# Altium schematic sheet ESP32.SchDoc: Motherboard-ESP32
size A3; DrawnBy: Patryk Bujak; DocumentNumber: 12; Revision: 1.0; SheetNumber: 9; SheetTotal: 10; Author: Patryk Bujak
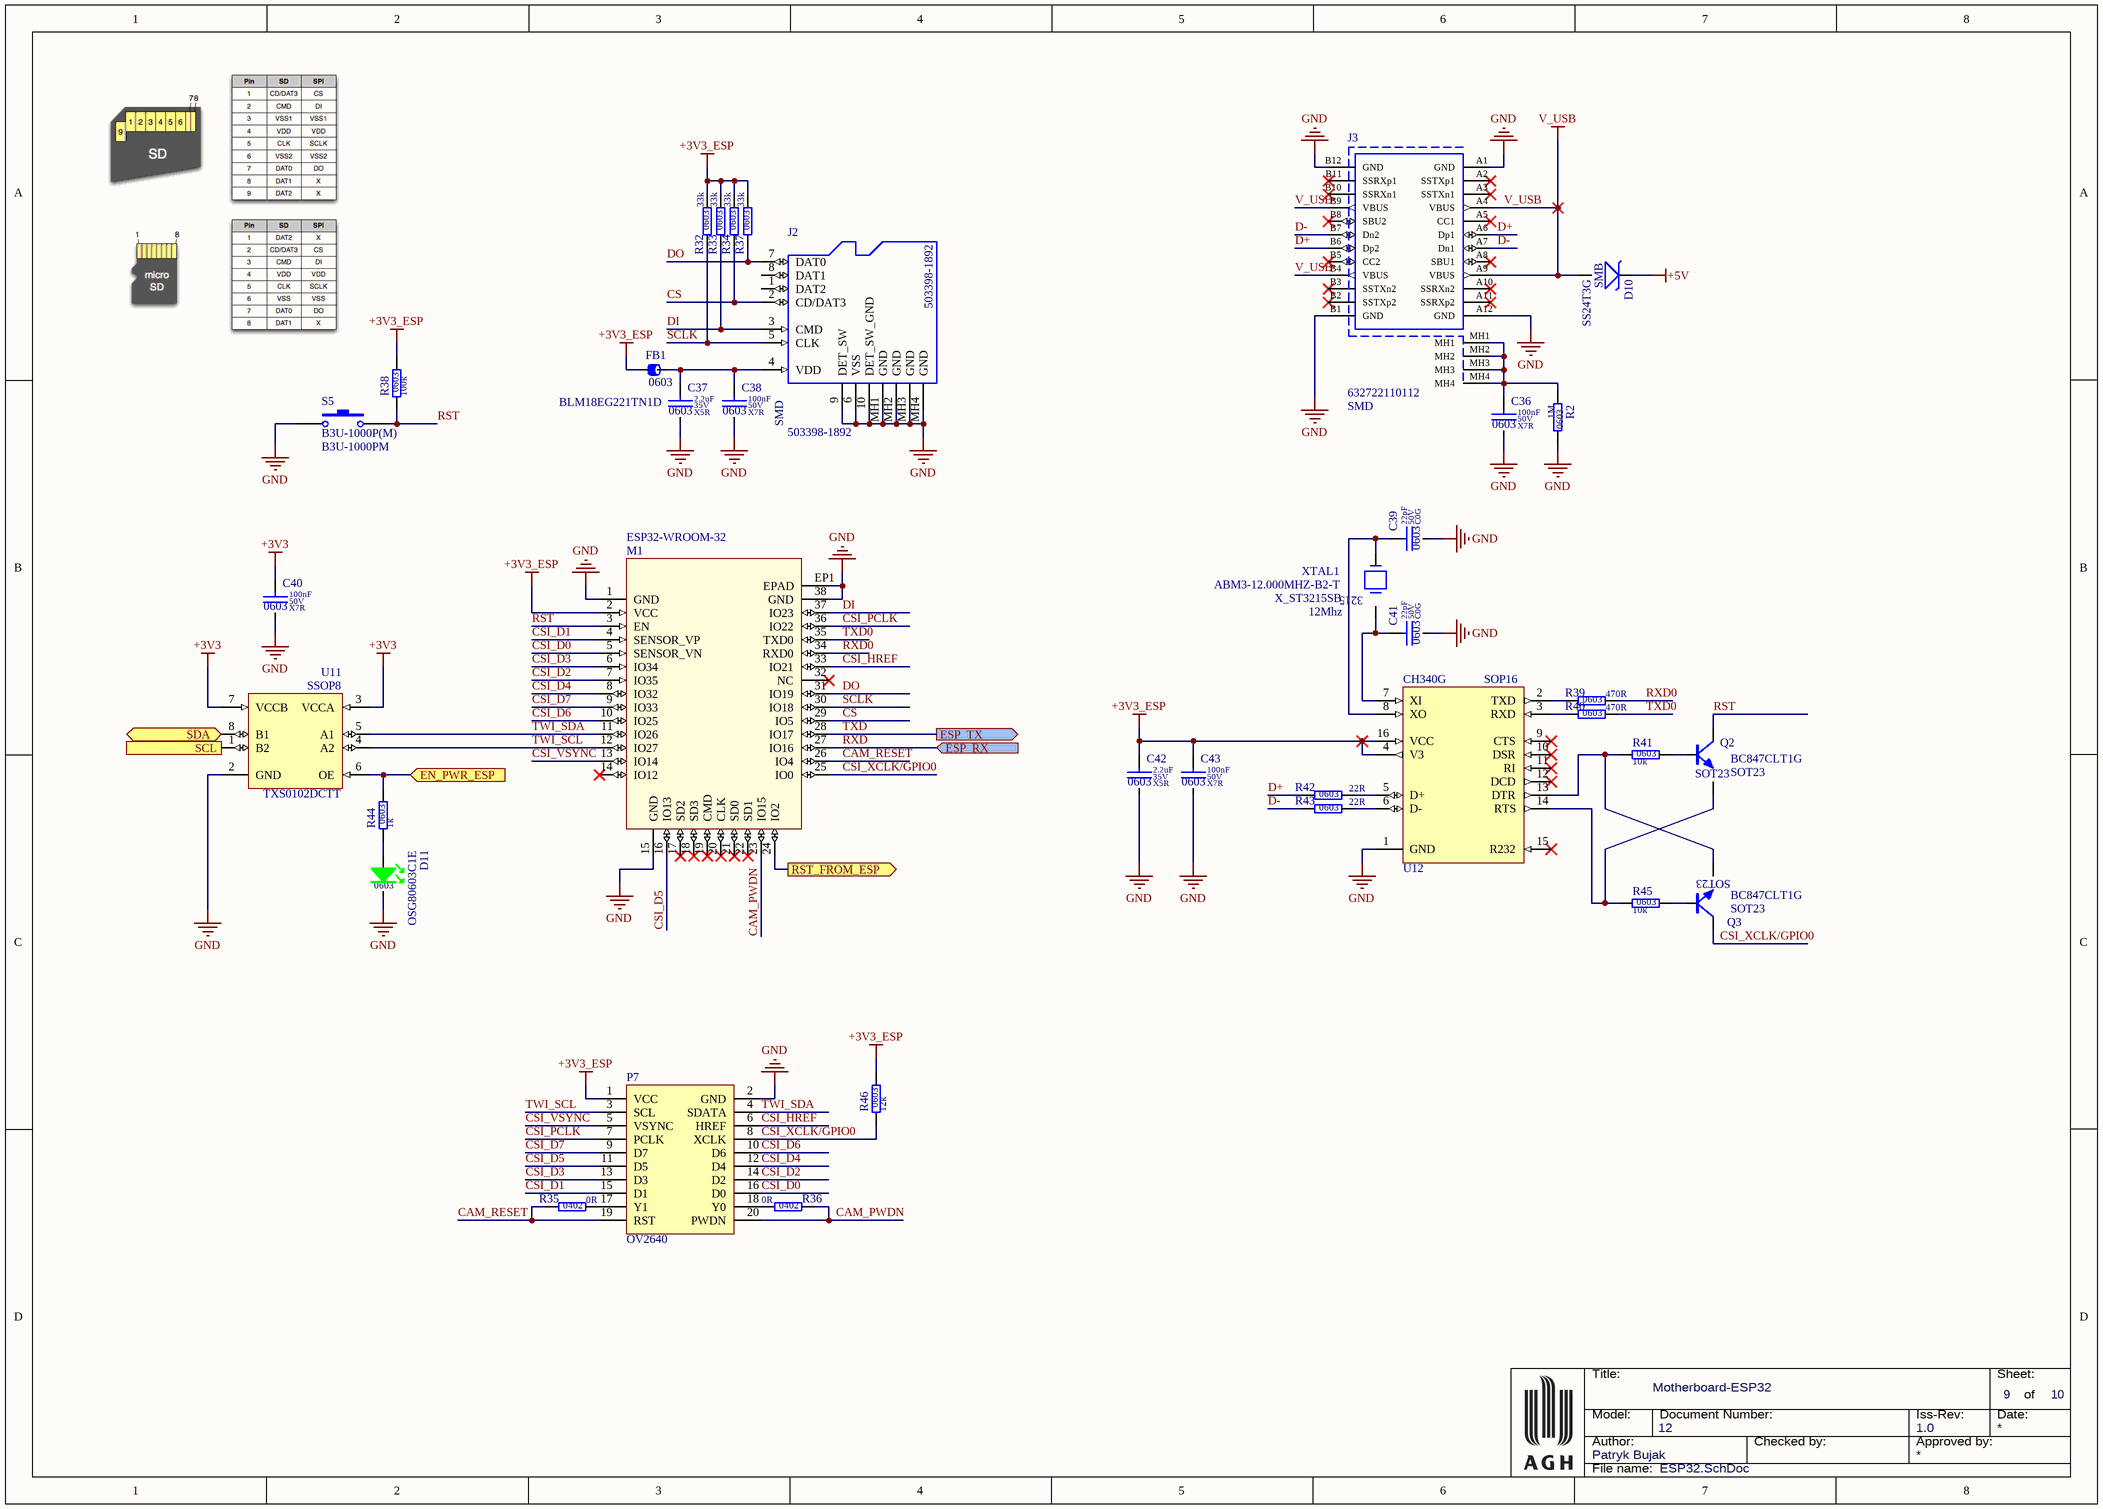
[diagram p0: ESP32.SchDoc]

## Parts
C36  value 100nF  Dielectric: X7R  Voltage: 50V  SCH_Footprint: 0603  [C_0603_1608]  (hidden comment: Ceramic X7R)
C37  value 2.2uF  Dielectric: X5R  Voltage: 35V  SCH_Footprint: 0603  [C_0603_1608]  (hidden comment: Ceramic X5R)
C38  value 100nF  Dielectric: X7R  Voltage: 50V  SCH_Footprint: 0603  [C_0603_1608]  (hidden comment: Ceramic X7R)
C39  value 22pF  Dielectric: C0G  Voltage: 50V  SCH_Footprint: 0603  [C_0603_1608]  (hidden comment: Ceramic C0G)
C40  value 100nF  Dielectric: X7R  Voltage: 50V  SCH_Footprint: 0603  [C_0603_1608]  (hidden comment: Ceramic X7R)
C41  value 22pF  Dielectric: C0G  Voltage: 50V  SCH_Footprint: 0603  [C_0603_1608]  (hidden comment: Ceramic C0G)
C42  value 2.2uF  Dielectric: X5R  Voltage: 35V  SCH_Footprint: 0603  [C_0603_1608]  (hidden comment: Ceramic X5R)
C43  value 100nF  Dielectric: X7R  Voltage: 50V  SCH_Footprint: 0603  [C_0603_1608]  (hidden comment: Ceramic X7R)
D10  value SS24T3G  SCH_Footprint: SMB  [SMB_DO-214AA]  (hidden comment: SS24)
D11  value OSG80603C1E  SCH_Footprint: 0603  [OL_0603_1608]  (hidden comment: Green led)
FB1  value BLM18EG221TN1D  SCH_Footprint: 0603  [FB_0603_1608]  (hidden comment: Ferrite bead)
J2  value 503398-1892  SCH_Footprint: SMD  [503398-1892]  (hidden comment: SD Card Connector)
J3  value 632722110112  SCH_Footprint: SMD  [J_USB_C_3.1_Vertical]  (hidden comment: USB C Connector)
M1  value ESP32-WROOM-32  [MOD_ESP_WROOM_32]  (hidden comment: 2.4 GHz Wi-Fi-and-Bluetooth combo chip)
P7  OV2640  [H2X10_OV2640]
Q2  value BC847CLT1G  SCH_Footprint: SOT23  [SOT23_TO236_SC59]  (hidden comment: BC847C)
Q3  value BC847CLT1G  SCH_Footprint: SOT23  [SOT23_TO236_SC59]  (hidden comment: BC847C)
R2  value 1M  SCH_Footprint: 0603  [R_0603_1608]  (hidden comment: Resistor)
R32  value 33k  SCH_Footprint: 0603  [R_0603_1608]  (hidden comment: Resistor)
R33  value 33k  SCH_Footprint: 0603  [R_0603_1608]  (hidden comment: Resistor)
R34  value 33k  SCH_Footprint: 0603  [R_0603_1608]  (hidden comment: Resistor)
R35  value 0R  SCH_Footprint: 0402  [R_0402_1005]  (hidden comment: Resistor)
R36  value 0R  SCH_Footprint: 0402  [R_0402_1005]  (hidden comment: Resistor)
R37  value 33k  SCH_Footprint: 0603  [R_0603_1608]  (hidden comment: Resistor)
R38  value 100k  SCH_Footprint: 0603  [R_0603_1608]  (hidden comment: Resistor)
R39  value 470R  SCH_Footprint: 0603  [R_0603_1608]  (hidden comment: Resistor)
R40  value 470R  SCH_Footprint: 0603  [R_0603_1608]  (hidden comment: Resistor)
R41  value 10k  SCH_Footprint: 0603  [R_0603_1608]  (hidden comment: Resistor)
R42  value 22R  SCH_Footprint: 0603  [R_0603_1608]  (hidden comment: Resistor)
R43  value 22R  SCH_Footprint: 0603  [R_0603_1608]  (hidden comment: Resistor)
R44  value 1k  SCH_Footprint: 0603  [R_0603_1608]  (hidden comment: Resistor)
R45  value 10k  SCH_Footprint: 0603  [R_0603_1608]  (hidden comment: Resistor)
R46  value 12k  SCH_Footprint: 0603  [R_0603_1608]  (hidden comment: Resistor)
S5  value B3U-1000PM  SCH_Footprint: B3U-1000P(M)  [B3U-1000P]  (hidden comment: Ultra-small Tactile Switch)
U11  value TXS0102DCTT  SCH_Footprint: SSOP8  [SSOP8_3x3]  (hidden comment: 2-Bit Bidirectional Voltage-Level Shifter for Open-Drain and Push-Pull Application 8-VSSOP -40 to 85)
U12  value CH340G  SCH_Footprint: SOP16  [SOP16_SO16_SOIC16_4X10X6]  (hidden comment: USB to serial chip)
XTAL1  value 12Mhz  Manufacturer Part Number: ABM3-12.000MHZ-B2-T  [X_ABM3-12.000MHZ-B2-T]  (hidden comment: X_ST3215SB)

## Ports
EN_PWR_ESP (in), ESP_RX (in), ESP_TX (out), RST_FROM_ESP (out), SCL (in), SDA (bidir)

## Nets
+3V3: C40.1 U11.3(VCCA) U11.7(VCCB)
+3V3_ESP: C42.1 C43.1 FB1.1 M1.2(VCC) P7.1(VCC) R32.2 R33.2 R34.2 R37.2 R38.2 R46.2 U12.4(V3) U12.16(VCC)
+5V: D10.1
GND: C36.2 C37.2 C38.2 C39.2 C40.2 C41.2 C42.2 C43.2 D11.1(K) J2.6(VSS) J2.9(DET_SW) J2.10(DET_SW_GND) J2.MH1(GND) J2.MH2(GND) J2.MH3(GND) J2.MH4(GND) J3.A1(GND) J3.A12(GND) J3.B1(GND) J3.B12(GND) M1.1(GND) M1.15(GND) M1.38(GND) M1.EP1(EPAD) P7.2(GND) R2.2 S5.1 U11.2(GND) U12.1(GND)
V_USB: D10.2 J3.A4(VBUS) J3.A9(VBUS) J3.B4(VBUS) J3.B9(VBUS)
CAM_PWDN: M1.23(IO15) P7.20(PWDN) R36.2
CAM_RESET: M1.26(IO4) P7.19(RST) R35.1
CS: J2.2(CD/DAT3) M1.29(IO5) R34.1
CSI_D0: M1.5(SENSOR_VN) P7.16(D0)
CSI_D1: M1.4(SENSOR_VP) P7.15(D1)
CSI_D2: M1.7(IO35) P7.14(D2)
CSI_D3: M1.6(IO34) P7.13(D3)
CSI_D4: M1.8(IO32) P7.12(D4)
CSI_D5: M1.16(IO13) P7.11(D5)
CSI_D6: M1.10(IO25) P7.10(D6)
CSI_D7: M1.9(IO33) P7.9(D7)
CSI_HREF: M1.33(IO21) P7.6(HREF)
CSI_PCLK: M1.36(IO22) P7.7(PCLK)
CSI_VSYNC: M1.13(IO14) P7.5(VSYNC)
CSI_XCLK/GPIO0: M1.25(IO0) P7.8(XCLK) Q3.3(C) R46.1
D+: J3.A6(Dp1) J3.B6(Dp2) R42.1
D-: J3.A7(Dn1) J3.B7(Dn2) R43.1
DI: J2.3(CMD) M1.37(IO23) R33.1
DO: J2.7(DAT0) M1.31(IO19) R37.1
EN_PWR_ESP: R44.2 U11.6(OE) ; port EN_PWR_ESP
RST: M1.3(EN) Q2.3(C) R38.1 S5.2
RST_FROM_ESP: M1.24(IO2) ; port RST_FROM_ESP
RXD: M1.27(IO16) ; port ESP_RX
RXD0: M1.34(RXD0) R39.2
SCL: U11.1(B2) ; port SCL
SCLK: J2.5(CLK) M1.30(IO18) R32.1
SDA: U11.8(B1) ; port SDA
TWI_SCL: M1.12(IO27) P7.3(SCL) U11.4(A2)
TWI_SDA: M1.11(IO26) P7.4(SDATA) U11.5(A1)
TXD: M1.28(IO17) ; port ESP_TX
TXD0: M1.35(TXD0) R40.2
NetC36_1: C36.1 J3.MH1 J3.MH2 J3.MH3 J3.MH4 R2.1
NetC37_1: C37.1 C38.1 FB1.2 J2.4(VDD)
NetC39_1: C39.1 U12.8(XO) XTAL1.2
NetC41_1: C41.1 U12.7(XI) XTAL1.1
NetD11_2: D11.2(A) R44.1
NetP7_17: P7.17(Y1) R35.2
NetP7_18: P7.18(Y0) R36.1
NetQ2_1: Q2.1(B) R41.2
NetQ2_2: Q2.2(E) R45.1 U12.14(RTS)
NetQ3_1: Q3.1(B) R45.2
NetQ3_2: Q3.2(E) R41.1 U12.13(DTR)
NetR39_1: R39.1 U12.2(TXD)
NetR40_1: R40.1 U12.3(RXD)
NetR42_2: R42.2 U12.5(D+)
NetR43_2: R43.2 U12.6(D-)

Not connected (* = marked no-connect by the designer): J2 1(DAT2) 8(DAT1); J3 A2(SSTXp1)* A3(SSTXn1)* A5(CC1)* A8(SBU1)* A10(SSRXn2)* A11(SSRXp2)* B2(SSTXp2)* B3(SSTXn2)* B5(CC2)* B8(SBU2)* B10(SSRXn1)* B11(SSRXp1)*; M1 14(IO12)* 17(SD2)* 18(SD3)* 19(CMD)* 20(CLK)* 21(SD0)* 22(SD1)* 32(NC)*; U12 9(CTS)* 10(DSR)* 11(RI)* 12(DCD)* 15(R232)*

## Notes on the sheet
- Title:
- Sheet:
- of
- Author:
- Model:
- Document Number:
- Checked by:
- Iss-Rev:
- Approved by:
- Date:
- File name:
- (in symbol X_ABM3-12.000MHZ-B2-T) 3215

## Library data of the parts
C36 C38 C40 C43 = C_100nF_50V_X7R_0603_5: Capacitor; Manufacturer: Samsung; Manufacturer Part Number: CL10B104JB8NNNC; Tolerance (%): 5; Part Number: C_100nF_50V_X7R_0603_5; HelpURL: http://www.tme.eu/pl/Document/4a42202b32dab16128fe107dd69598cc/samsung-chip-cap.pdf; Supplier 1: TME; Supplier Part Number 1: CL10B104JB8NNNC; Supplier 2: RS Components; Supplier 3: Farnell; Supplier 4: Mouser; Supplier 5: Digi-Key
C37 C42 = C_2.2uF_35V_X5R_0603_10: Capacitor; Manufacturer: Murata; Manufacturer Part Number: GRM188R6YA225KA12D; Tolerance (%): 10; Part Number: C_2.2uF_35V_X5R_0603_10; HelpURL: https://datasheet.octopart.com/GRM188R6YA225KA12D-Murata-datasheet-66077095.pdf; Supplier 1: TME; Supplier 2: RS Components; Supplier Part Number 2: 8151358; Supplier 3: Farnell; Supplier Part Number 3: 2611926; Supplier 4: Mouser; Supplier Part Number 4: 81-GRM188R6YA225KA2D; Supplier 5: Digi-Key; Supplier Part Number 5: 490-7204-1-ND
C39 C41 = C_22pF_50V_C0G_0603_5: Capacitor; Manufacturer: AVX; Manufacturer Part Number: 06035A220JAT2A; Tolerance (%): 5; Part Number: C_22pF_50V_C0G_0603_5; HelpURL: https://datasheet.octopart.com/06035A220JAT2A-AVX-datasheet-9883399.pdf; Supplier 1: TME; Supplier 2: RS Components; Supplier Part Number 2: 1349628; Supplier 3: Farnell; Supplier Part Number 3: 2280861; Supplier 4: Mouser; Supplier Part Number 4: 581-06035A220J; Supplier 5: Digi-Key; Supplier Part Number 5: 478-1167-1-ND
D10 = DS_SS24_2A_40V_SMB: Manufacturer: ON Semiconductor; Voltage: 40V; Current: 2A; Part Number: DS_SS24_2A_40V_SMB; Manufacturer Part Number: SS24T3G; Supplier 1: TME; Supplier 2: RS Components; Supplier 3: Farnell; Supplier 4: Mouser; Supplier 5: Digi-Key; Supplier Part Number 5: SS24T3GOSCT-ND
D11 = OL_G_0603_OSG80603C1E: LED GREEN; Manufacturer: Optosupply; Part Number: OL_G_0603_OSG80603C1E; Manufacturer Part Number: OSG80603C1E; Supplier 1: TME; Supplier Part Number 1: OSG80603C1E; Supplier 2: RS Components; Supplier 3: Farnell; Supplier 4: Mouser; Supplier 5: Digi-Key
FB1 = FB_BLM18EG221TN1D: Manufacturer: Murata; Current: 1A; Resistance: 150mR; Part Number: FB_BLM18EG221TN1D; HelpURL: http://datasheet.octopart.com/BLM18EG221TN1D-Murata-datasheet-66919.pdf; Manufacturer Part Number: BLM18EG221TN1D; Supplier 1: TME; Supplier 2: RS Components; Supplier Part Number 2: 7926243P; Supplier 3: Farnell; Supplier Part Number 3: 1515717; Supplier 4: Mouser; Supplier Part Number 4: 81-BLM18EG221TN1D; Supplier 5: Digi-Key; Supplier Part Number 5: 490-5979-1-ND
J2 = J_MICRO_SD_503398-1892: J_MICRO_SD; Manufacturer: Molex; Manufacturer Part Number: 503398-1892; Part Number: J_MICRO_SD_503398-1892; Component Type: Standard; HelpURL: https://www.molex.com/pdm_docs/sd/5033981892_sd.pdf; Supplier 1: TME; Supplier Part Number 1: MX-503398-1892; Supplier 2: RS Components; Supplier Part Number 2: 8801277P; Supplier 3: Farnell; Supplier Part Number 3: 2358233; Supplier 4: Mouser; Supplier Part Number 4: 538-503398-1892; Supplier 5: Digi-Key; Supplier Part Number 5: WM11190CT-ND
J3 = J_USB_C_3.1_Vertical: Manufacturer: Wurth; Part Number: J_USB_C_3.1_Vertical; Component Type: Standard; HelpURL: https://docs-emea.rs-online.com/webdocs/16e6/0900766b816e664c.pdf; Manufacturer Part Number: 632722110112; Supplier 1: TME; Supplier 2: RS Components; Supplier Part Number 2: 185-4394; Supplier 3: Farnell; Supplier 4: Mouser; Supplier Part Number 4: 710-632722110112; Supplier 5: Digi-Key; Supplier Part Number 5: 732-13724-1-ND
M1 = MOD_ESP32-WROOM-32: Manufacturer: ESPRESSIF; SCH_Footprint: MOD_ESP_WROOM_32; Part Number: MOD_ESP32-WROOM-32; HelpURL: https://www.espressif.com/sites/default/files/documentation/esp32_datasheet_en.pdf; Manufacturer Part Number: ESP32-WROOM-32; Supplier 1: TME; Supplier Part Number 1: ESP32-WROOM-32; Supplier 2: RS Components; Supplier Part Number 2: 169-7594; Supplier 3: Farnell; Supplier 4: Mouser; Supplier Part Number 4: 356-ESP-WROOM-32; Supplier 5: Digi-Key; Supplier Part Number 5: 1904-1010-1-ND
P7 = OV2640: Header, 11-Pin, Dual row, Right Angle; LatestRevisionDate: 17-Jul-2002; LatestRevisionNote: Re-released for DXP Platform.; Publisher: Altium Limited; botland: https://botland.com.pl/pl/kamery-do-arduino-i-raspberry-pi/6562-modul-kamery-arducam-ov2640-2mpx-1600x1200px-60fps.html?search_query=OV2640&results=11; link: https://www.arducam.com/products/camera-breakout-board/2mp-ov2640/
Q2 Q3 = QNP_BC847C_45V_0A1: Manufacturer: ON Semiconductor; Type: NPN; Voltage: 45V; Current: 0A1; Part Number: QNP_BC847C_45V_0A1; HelpURL: https://assets.nexperia.com/documents/data-sheet/BC847_SER.pdf; Manufacturer Part Number: BC847CLT1G; Supplier 1: TME; Supplier Part Number 1: BC847CLT1G; Supplier 2: RS Components; Supplier 3: Farnell; Supplier 4: Mouser; Supplier 5: Digi-Key; Supplier Part Number 5: BC847CLT1GOSCT-ND
R2 = R_1M_0603_1: Manufacturer: Bourns; Manufacturer Part Number: CR0603-FX-1004ELF; Voltage: 50V; Power: 100mW; Tolerance: 1%; Part Number: R_1M_0603_1; HelpURL: https://datasheet.octopart.com/CR0603-FX-1004ELF-Bourns-datasheet-5318152.pdf; Supplier 1: TME; Supplier 2: RS Components; Supplier 3: Farnell; Supplier Part Number 3: 2321755; Supplier 4: Mouser; Supplier Part Number 4: 652-CR0603FX-1004ELF; Supplier 5: Digi-Key; Supplier Part Number 5: CR0603-FX-1004ELFCT-ND
R32-R34 R37 = R_33k_0603_1: Manufacturer: Vishay; Manufacturer Part Number: CRCW060333K0FKTABC; Voltage: 75V; Power: 100mW; Tolerance: 1%; Part Number: R_33k_0603_1; HelpURL: http://www.tme.eu/pl/Document/622e28308c06d160637f2b14751ba16b/Data%20Sheet%20CRCW_BCe3.pdf; Supplier 1: TME; Supplier Part Number 1: CRCW060333K0FKTABC; Supplier 2: RS Components; Supplier 3: Farnell; Supplier 4: Mouser; Supplier Part Number 4: 71-CRCW0603-33K; Supplier 5: Digi-Key
R35 R36 = R_0R_0402_5: Manufacturer: Rohm; Manufacturer Part Number: PMR01ZZPJ000; Voltage: 50V; Power: 100mW; Tolerance: 5%; Part Number: R_0R_0402_5; HelpURL: https://pl.mouser.com/datasheet/2/348/pmr-jpw-e-1139188.pdf; Supplier 1: TME; Supplier 2: RS Components; Supplier 3: Farnell; Supplier 4: Mouser; Supplier Part Number 4: 755-PMR01ZZPJ000; Supplier 5: Digi-Key; Supplier Part Number 5: RHM1692-6-ND
R38 = R_100k_0603_1: Manufacturer: Royalohm; Manufacturer Part Number: 0603SAF1003T5E; Voltage: 50V; Power: 100mW; Tolerance: 1%; Part Number: R_100k_0603_1; HelpURL: http://www.tme.eu/pl/Document/b315665a56acbc42df513c99b390ad98/ROYALOHM-THICKFILM.pdf; Supplier 1: TME; Supplier Part Number 1: SMD0603-100K-1%; Supplier 2: RS Components; Supplier 3: Farnell; Supplier 4: Mouser; Supplier Part Number 4: 667-ERJ-3EKF1003V; Supplier 5: Digi-Key; Supplier Part Number 5: P100KHCT-ND
R39 R40 = R_470R_0603_1: Manufacturer: Yageo; Manufacturer Part Number: RC0603FR-07470RL; Voltage: 50V; Power: 100mW; Tolerance: 1%; Part Number: R_470R_0603_1; HelpURL: http://www.tme.eu/en/Document/9fef8ccbb584e9f6a1c931cf356afd5c/PYu-RC0603_51_RoHS_L_4.pdf; Supplier 1: TME; Supplier Part Number 1: RC0603FR-07470R; Supplier 2: RS Components; Supplier 3: Farnell; Supplier Part Number 3: 9238441; Supplier 4: Mouser; Supplier Part Number 4: 603-RC0603FR-07470RL; Supplier 5: Digi-Key; Supplier Part Number 5: 311-470HRCT-ND
R41 R45 = R_10k_0603_1: Manufacturer: Vishay; Manufacturer Part Number: CRCW060310K0FKTABC; Voltage: 75V; Power: 100mW; Tolerance: 1%; Part Number: R_10k_0603_1; HelpURL: http://www.tme.eu/pl/Document/622e28308c06d160637f2b14751ba16b/Data%20Sheet%20CRCW_BCe3.pdf; Supplier 1: TME; Supplier Part Number 1: CRCW060310K0FKTABC; Supplier 2: RS Components; Supplier 3: Farnell; Supplier 4: Mouser; Supplier Part Number 4: 667-ERJ-3EKF1002V; Supplier 5: Digi-Key; Supplier Part Number 5: P10KGCT-ND
R42 R43 = R_22R_0603_5: Manufacturer: Walsin; Manufacturer Part Number: WF06P220JTL; Voltage: 50V; Power: 125mW; Tolerance: 5%; Part Number: R_22R_0603_5; HelpURL: http://www.tme.eu/pl/Document/b315665a56acbc42df513c99b390ad98/ROYALOHM-THICKFILM.pdf; Supplier 1: TME; Supplier Part Number 1: WF06P-22R-5%; Supplier 2: RS Components; Supplier 3: Farnell; Supplier 4: Mouser; Supplier 5: Digi-Key
R44 = R_1k_0603_1: Manufacturer: Vishay; Manufacturer Part Number: CRCW06031K00FKEA; Voltage: 75V; Power: 100mW; Tolerance: 1%; Part Number: R_1k_0603_1; HelpURL: http://www.farnell.com/datasheets/2310790.pdf?_ga=2.256888843.1690599162.1548417389-1379097396.1542296996&_gac=1.262631934.1547230258.Cj0KCQiAmuHhBRD0ARIsAFWyPwhX8HcvXnM3tA0ZBodZLzDIjH2ZxLpjT5LWo9bad_HPRbU8LfPq44UaAhEwEALw_wcB; Supplier 1: TME; Supplier 2: RS Components; Supplier Part Number 2: 678-9875P; Supplier 3: Farnell; Supplier Part Number 3: 1469740; Supplier 4: Mouser; Supplier Part Number 4: 71-CRCW0603-1.0K-E3; Supplier 5: Digi-Key; Supplier Part Number 5: 541-1.00KHCT-ND
R46 = R_12k_0603_1: Manufacturer: Yageo; Manufacturer Part Number: RC0603FR-0712KL; Voltage: 50V; Power: 100mW; Tolerance: 1%; Part Number: R_12k_0603_1; HelpURL: http://www.tme.eu/pl/Document/d2a72e545e5c8eb7bf2a04fa97535928/rc0603yageo.pdf; Supplier 1: TME; Supplier Part Number 1: RC0603FR-0712K; Supplier 2: RS Components; Supplier 3: Farnell; Supplier Part Number 3: 2693657; Supplier 4: Mouser; Supplier Part Number 4: 603-RC0603FR-0712KL; Supplier 5: Digi-Key; Supplier Part Number 5: 311-12.0KHRCT-ND
S5 = S_B3U-1000PM: Tact Switch; Manufacturer: OMRON; Part Number: S_B3U-1000PM; HelpURL: https://www.tme.eu/Document/abdade7e1ca56d20235b5c747d7227eb/B3U.PDF; Manufacturer Part Number: B3U-1000PM; Supplier 1: TME; Supplier Part Number 1: B3U-1000PM; Supplier 2: RS Components; Supplier 3: Farnell; Supplier 4: Mouser; Supplier Part Number 4: 653-B3U-1000PM; Supplier 5: Digi-Key
U11 = U_TXS0102DCTT: Manufacturer: Texas Instruments; Part Number: U_TXS0102DCTT; HelpURL: http://www.ti.com/lit/ds/symlink/txs0102.pdf; Manufacturer Part Number: TXS0102DCTT; Supplier 1: TME; Supplier 2: RS Components; Supplier Part Number 2: 7098912P; Supplier 3: Farnell; Supplier Part Number 3: 2098018; Supplier 4: Mouser; Supplier Part Number 4: 595-TXS0102DCTT; Supplier 5: Digi-Key; Supplier Part Number 5: 296-32603-1-ND
U12 = U_CH340G: Manufacturer: WCH; Part Number: U_CH340G; HelpURL: https://www.mpja.com/download/35227cpdata.pdf; Manufacturer Part Number: CH340G; Supplier 1: TME; Supplier 2: RS Components; Supplier 3: Farnell; Supplier 4: Mouser; Supplier 5: Digi-Key; Supplier 6: WCH; Supplier Part Number 6: CH340G
XTAL1 = X_ABM3-12.000MHZ-B2-T: Manufacturer: ABM3; Part Number: X_ABM3-12.000MHZ-B2-T; SCH_Footprint: X_ST3215SB; HelpURL: http://www.mouser.com/ds/2/3/abm3-47699.pdf; Supplier 1: TME; Supplier 2: RS Components; Supplier 3: Farnell; Supplier Part Number 3: 2467787; Supplier 4: Mouser; Supplier 5: Digi-Key; Supplier Part Number 5: 535-9100-1-ND